# EAGLE design xyshield_final (EAGLE 6.5.0)
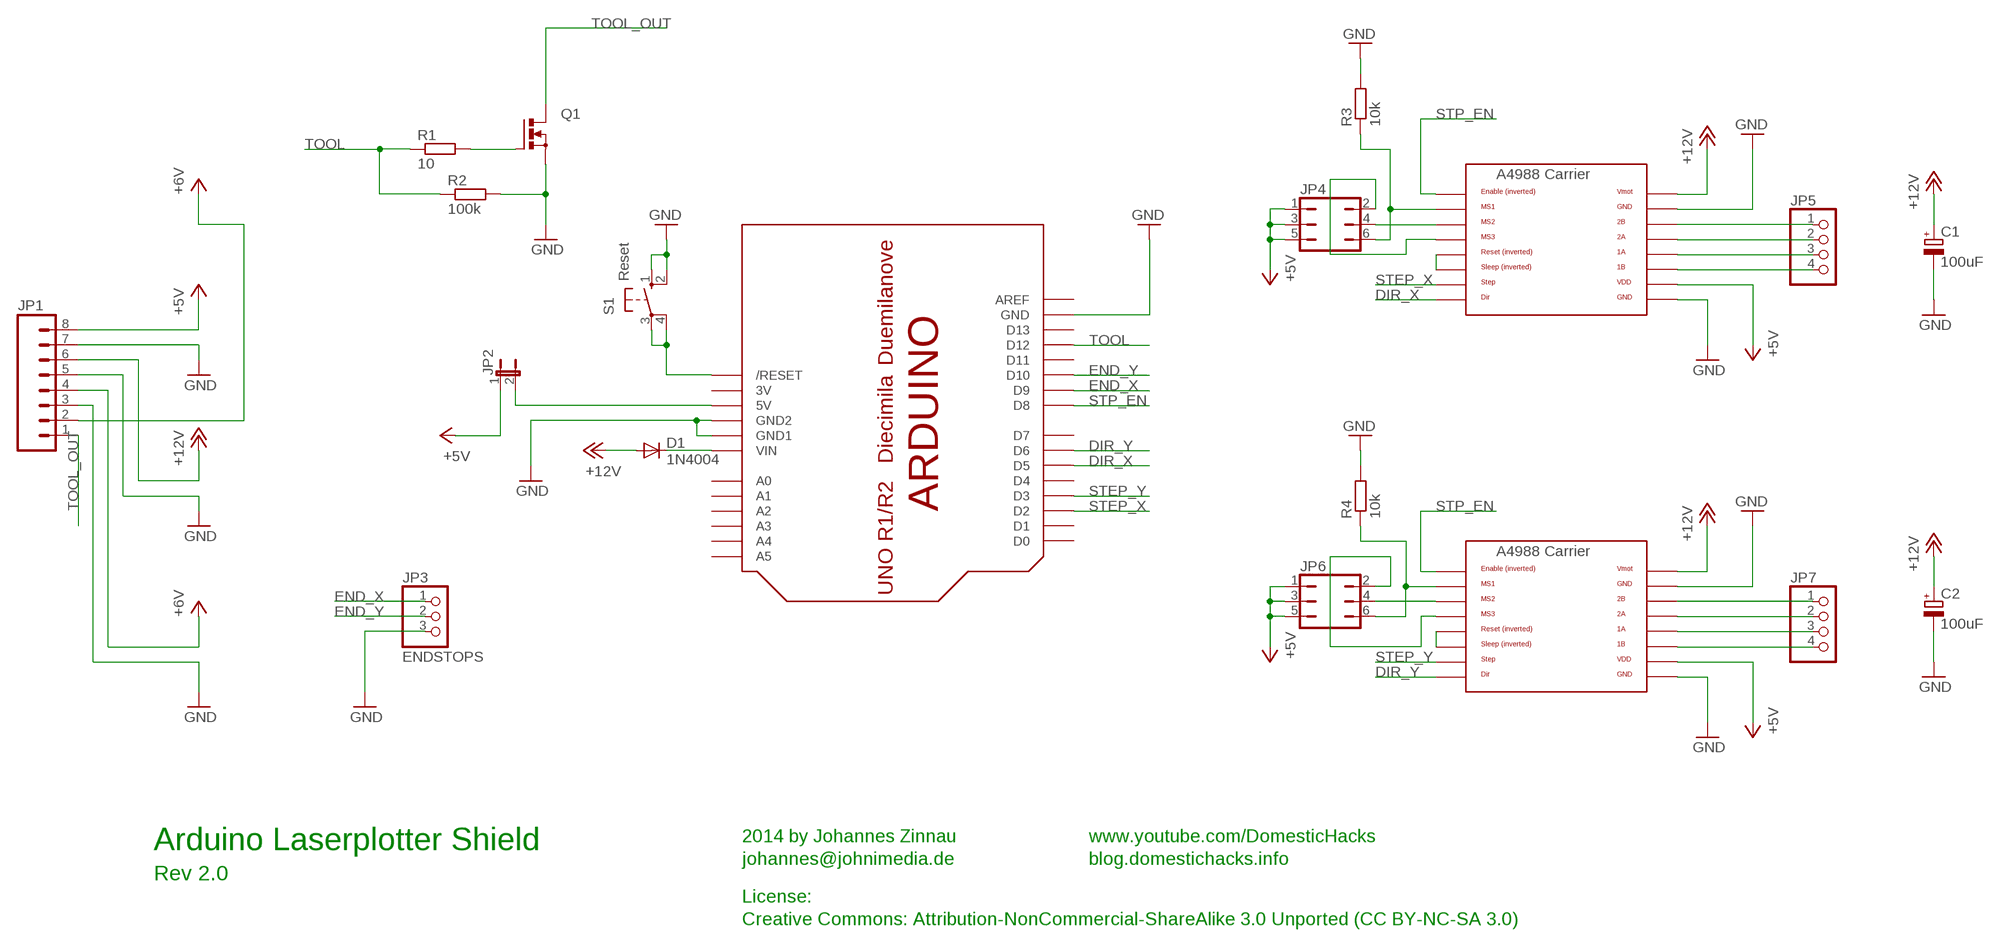
[diagram p0: schematic, sheet 1]

## Parts
C1  100uF  CPOL-EUE2.5-6  [E2,5-6]
C2  100uF  CPOL-EUE2.5-6  [E2,5-6]
D1  1N4004  [DO41-10]
JP1  M083.5MM-8  [SCREWTERMINAL-3.5MM-8]
JP2  JUMPER-2PTH  [1X02]
JP3  ENDSTOPS  PINHD-1X3  [1X03]
JP4  JP3Q  [JP3Q]
JP5  PINHD-1X4  [1X04]
JP6  JP3Q  [JP3Q]
JP7  PINHD-1X4  [1X04]
Q1  PMOSFET_NTO220BV  [TO220BV]
R1  10  R-EU_0207/10  [0207/10]
R2  100k  R-EU_0207/10  [0207/10]
R3  10k  R-EU_0207/2V  [0207/2V]
R4  10k  R-EU_0207/2V  [0207/2V]
S1  Reset  10-XX  [B3F-10XX]
U$1  POLOLU_A4983CARRIER  [A4988BREAKOUT]
U$2  POLOLU_A4983CARRIER  [A4988BREAKOUT]
U$3  ARDUINOUNO  [ARDUINO]

## Nets
+5V: JP1.8 JP2.1 JP4.1 JP4.3 JP4.5 JP6.1 JP6.3 JP6.5 U$1.VDD U$2.VDD
+12V: C1.+ C2.+ D1.A JP1.6 U$1.VMOT U$2.VMOT
DIR_X: U$1.DIR U$3.D5
DIR_Y: U$2.DIR U$3.D6
END_X: JP3.1 U$3.D9
END_Y: JP3.2 U$3.D10
GND: C1.- C2.- JP1.3 JP1.5 JP1.7 JP3.3 Q1.S R2.2 R3.2 R4.2 S1.1(S) S1.2(S1) U$1.GND U$1.GND@0(GND) U$2.GND U$2.GND@0(GND) U$3.GND U$3.GND1 U$3.GND2
N$2: Q1.G R1.2
N$3: U$1.RST U$1.SLP(SLEEP)
N$4: JP5.3 U$1.1A
N$5: JP5.2 U$1.2A
N$6: JP5.1 U$1.2B
N$7: JP5.4 U$1.1B
N$8: JP4.6 R3.1 U$1.MS1
N$9: JP4.4 U$1.MS2
N$10: JP4.2 U$1.MS3
N$11: U$2.RST U$2.SLP(SLEEP)
N$12: JP7.4 U$2.1B
N$13: JP7.3 U$2.1A
N$14: JP7.2 U$2.2A
N$15: JP7.1 U$2.2B
N$16: JP6.6 R4.1 U$2.MS1
N$17: JP6.4 U$2.MS2
N$18: JP6.2 U$2.MS3
N$19: JP2.2 U$3.5V
N$25: D1.C U$3.VIN
N$28: S1.3(P) S1.4(P1) U$3.RESET(/RESET)
STEP_X: U$1.STEP U$3.D2
STEP_Y: U$2.STEP U$3.D3
STP_EN: U$1.EN U$2.EN U$3.D8
TOOL: R1.1 R2.1 U$3.D12
TOOL_OUT: JP1.1 Q1.D
VCC: JP1.2 JP1.4 ; supply symbol labelled +6V
Unconnected: U$3.A0 U$3.A1 U$3.A2 U$3.A3 U$3.A4 U$3.A5 U$3.AREF U$3.D0 U$3.D1 U$3.D4 U$3.D7 U$3.D11 U$3.D13

## Notes on the sheet
- 2014 by Johannes Zinnau | www.youtube.com/DomesticHacks
- Arduino Laserplotter Shield
- johannes@johnimedia.de | blog.domestichacks.info
- Rev 2.0
- License:
- Creative Commons: Attribution-NonCommercial-ShareAlike 3.0 Unported (CC BY-NC-SA 3.0)

## Power pins joined to a net without a drawn wire
3V: U$3.3V

## Library data of the parts
C1 C2 = rcl:CPOL-EU: POLARIZED CAPACITOR, European symbol
D1 = diode:1N4004: DIODE general purpose rectifier, 1 A
JP1 = SparkFun-Connectors:M08: Header 8 Standard 8-pin 0.1" header. Use with straight break away headers (SKU : PRT-00116), right angle break away headers (PRT-00553), swiss pins (PRT-00743), machine pins (PRT-00117), and female headers (PRT-00115).
JP2 = SparkFun-Passives:JUMPER-2: Jumper Basic 0.1" spaced jumper. Use with breakaway headers.
JP3 = pinhead:PINHD-1X3: PIN HEADER
JP4 JP6 = jumper:JP3Q: JUMPER
JP5 JP7 = pinhead:PINHD-1X4: PIN HEADER
Q1 = transistor-power:PMOSFET_N: Power MOSFET N-Channel
R1-R4 = rcl:R-EU_: RESISTOR, European symbol
S1 = switch-omron:10-XX: OMRON SWITCH; MPN: B3F-1000; OC_FARNELL: 176432; OC_NEWARK: 36M3542
U$1 U$2 = RepRapjr:POLOLU_A4983CARRIER
U$3 = adafruit:ARDUINO: Arduino Diecimila/Duemilanove Make a shield with ease, this package has all the named pins as well as the two mounting drill holes and an outline of the USB and DC power connector. The outline is on the DIMENSION layer, so if your board house uses it they will cut the outline to match. http://www.ladyada.net/library/pcb/eaglelibrary.html

## Board
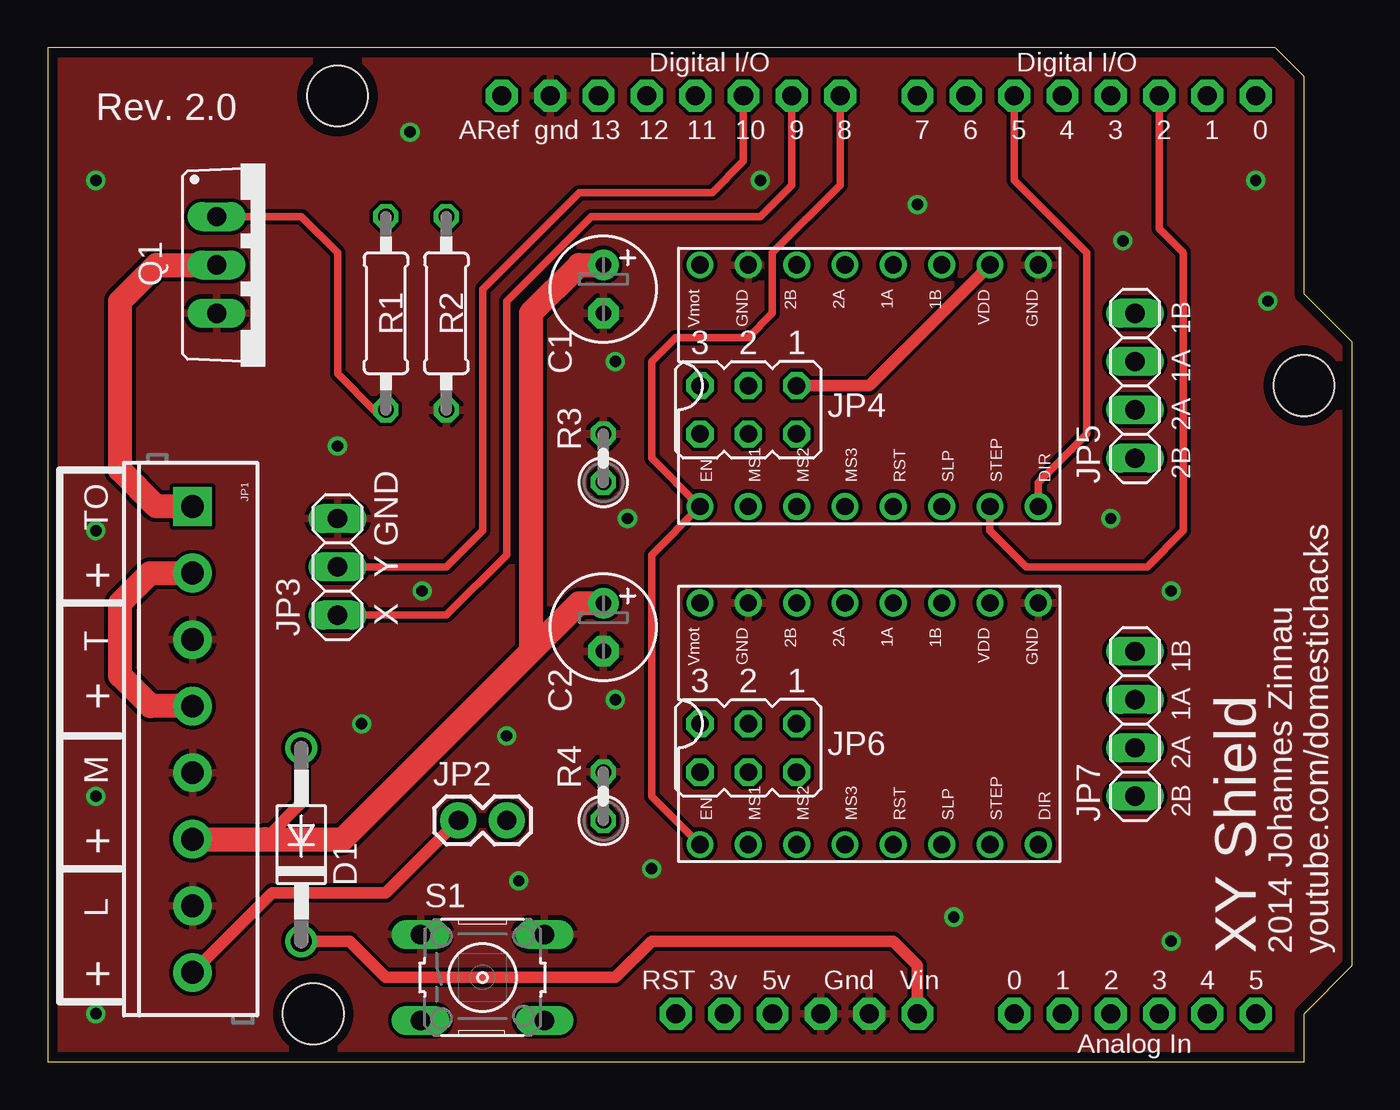
[diagram p1: board, top side]
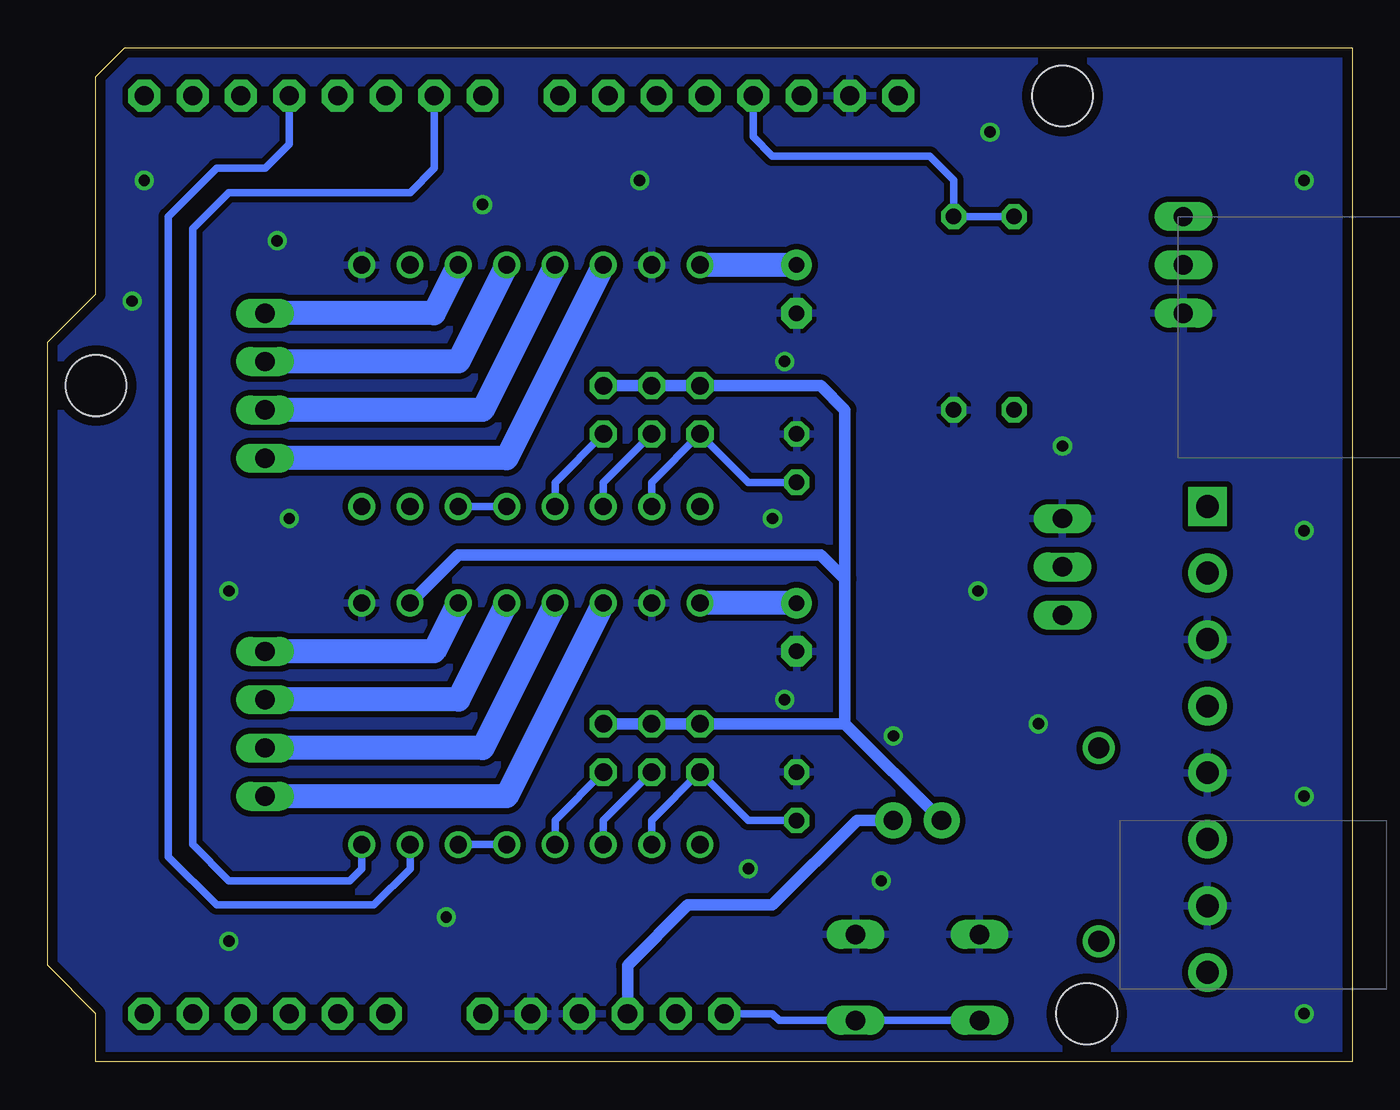
[diagram p2: board, bottom side, seen from below]

Size 68.58 x 53.34 mm. Coordinates in mm from the lower left corner, seen from the top.
Copper layers (1*16): Top 0.035mm / dielectric 1.5mm / Bottom 0.035mm
Design rules "default *": minimum track width 10mil, minimum drill 12mil, track to track 8mil, track to pad 8mil, pad to pad 8mil, via to via 8mil, smd to smd 8mil, copper to edge 20mil, drill to drill 10mil, minimum pad ring 10mil, minimum via ring 8mil, stop-mask expansion 4mil, vias tented up to drill 0mil, thermal gap 10mil

### Footprints (pad centres in the part's own frame; a part is rotated, then mirrored left to right if it is on the bottom)
E2,5-6 = drill 0.813 pad 1.6: + -1.27,0 | drill 0.813 pad 1.6 octagon: - 1.27,0
DO41-10 = drill 1.118: A 5.08,0; C -5.08,0
SCREWTERMINAL-3.5MM-8 = drill 1.2 pad 2.032 square: 1 0,0 | drill 1.2 pad 2.032: 2 3.5,0; 3 7,0; 4 10.5,0; 5 14,0; 6 17.5,0; 7 21,0; 8 24.5,0
1X02 = drill 1.016 pad 1.88: 1 0,0; 2 2.54,0
1X03 = drill 1.016 long: 1 -2.54,0; 2 0,0; 3 2.54,0
JP3Q = drill 0.914 octagon: 1 -2.54,-1.27; 2 -2.54,1.27; 3 0,-1.27; 4 0,1.27; 5 2.54,-1.27; 6 2.54,1.27
1X04 = drill 1.016 long: 1 -3.81,0; 2 -1.27,0; 3 1.27,0; 4 3.81,0
TO220BV = drill 1.016 long: D 0,-2.54; G -2.54,-2.54; S 2.54,-2.54
0207/10 = drill 0.813 octagon: 1 -5.08,0; 2 5.08,0
0207/2V = drill 0.813 octagon: 1 -1.27,0; 2 1.27,0
B3F-10XX = drill 1.016 long: 1 -3.251,2.261; 2 3.251,2.261; 3 -3.251,-2.261; 4 3.251,-2.261
A4988BREAKOUT = drill 0.9: 1A 8.89,1.27; 1B 11.43,1.27; 2A 6.35,1.27; 2B 3.81,1.27; DIR 16.51,-11.43; EN -1.27,-11.43; GND 16.51,1.27; GND@0 1.27,1.27; MS1 1.27,-11.43; MS2 3.81,-11.43; MS3 6.35,-11.43; RST 8.89,-11.43; SLP 11.43,-11.43; STEP 13.97,-11.43; VDD 13.97,1.27; VMOT -1.27,1.27
ARDUINO = drill 1 pad 1.676 octagon: 3V 35.56,2.54; 5V 38.1,2.54; A0 50.8,2.54; A1 53.34,2.54; A2 55.88,2.54; A3 58.42,2.54; A4 60.96,2.54; A5 63.5,2.54; AREF 23.876,50.8; D0 63.5,50.8; D1 60.96,50.8; D2 58.42,50.8; D3 55.88,50.8; D4 53.34,50.8; D5 50.8,50.8; D6 48.26,50.8; D7 45.72,50.8; D8 41.656,50.8; D9 39.116,50.8; D10 36.576,50.8; D11 34.036,50.8; D12 31.496,50.8; D13 28.956,50.8; GND 26.416,50.8; GND1 43.18,2.54; GND2 40.64,2.54; RESET 33.02,2.54; VIN 45.72,2.54 | hole 3.2: 15.24,50.8; 66.04,35.56; 13.97,2.54

### Placement (x,y rotation side)
C1  29.21,40.64 270 top
C2  29.21,22.86 270 top
D1  13.34,11.43 90 top
JP1  7.62,29.21 270 top
JP2  21.59,12.7 0 top
JP3  15.24,26.04 90 top
JP4  36.83,34.29 180 top
JP5  57.15,35.56 90 top
JP6  36.83,16.51 180 top
JP7  57.15,17.78 90 top
Q1  11.43,41.91 270 top
R1  17.78,39.37 270 top
R2  20.95,39.37 270 top
R3  29.21,31.75 90 top
R4  29.21,13.97 90 top
S1  22.86,4.45 0 top
U$1  35.56,40.64 0 top
U$2  35.56,22.86 0 top
U$3  0,0 0 top

### Tracks (layer width: path | path; a pad name or v marks a point on that pad's centre or on a via)
+5V
  Top 0.61: JP4.1 43.18,35.56 U$1.VDD | JP1.8 11.8,8.89 17.78,8.89 JP2.1
  Bottom 0.61: JP4.1 JP4.3 JP4.5 27.94,35.56 26.67,34.29 26.67,25.4 | 26.67,17.78 26.67,25.4 | 26.67,17.78 JP6.5 JP6.3 JP6.1 | U$2.VDD 46.99,26.67 27.94,26.67 26.67,25.4 | 26.67,17.78 JP2.1
+12V
  Top 0.61: D1.A 13.34,13.62 11.43,11.71
  Top 1.27: C1.+ 27.94,41.91 25.4,39.37 25.4,21.59 | C2.+ 27.94,24.13 25.4,21.59 | 25.4,21.59 15.52,11.71 11.43,11.71 JP1.6
  Bottom 1.27: C1.+ U$1.VMOT | C2.+ U$2.VMOT
DIR_X
  Top 0.406: U$3.D5 50.8,46.36 54.61,42.55 54.61,33.02 52.07,30.48 U$1.DIR
DIR_Y
  Bottom 0.406: U$2.DIR 52.07,10.16 52.7,9.53 59.05,9.53 60.96,11.43 60.96,43.82 59.05,45.72 49.53,45.72 48.26,46.99 U$3.D6
END_X
  Top 0.406: U$3.D9 39.12,46.1 37.47,44.45 28.57,44.45 24.13,40.01 24.13,26.67 20.95,23.5 JP3.1
END_Y
  Top 0.406: JP3.2 20.95,26.04 22.86,27.94 22.86,40.64 27.94,45.72 34.92,45.72 36.58,47.37 U$3.D10
GND  (via drill 0.6)
  other vias: 2.54,46.36 31.75,10.16 29.84,19.05 15.24,32.38 59.05,24.77 47.62,7.62 64.14,40.01 45.72,45.09 19.05,48.9 19.68,24.77 24.77,9.53 30.48,28.57 56.52,43.18 55.88,28.57 2.54,2.54 2.54,13.97 2.54,27.94 29.84,36.83 16.51,17.78 37.47,46.36 24.13,17.14 59.05,6.35 63.5,46.36
  pour Bottom (isolate 0.305): 0,53.34 64.77,53.34 66.04,52.07 66.04,40.64 68.58,38.1 68.58,5.08 66.04,2.54 66.04,0 0,0
  pour Top: 0,53.34 0,0 66.04,0 66.04,2.54 68.58,5.08 68.58,38.1 66.04,40.64 66.04,52.07 64.77,53.34
N$2
  Top 0.406: R1.2 17.14,34.29 15.24,36.2 15.24,42.55 13.34,44.45 Q1.G
N$3
  Bottom 0.406: U$1.RST U$1.SLP
N$4
  Bottom 1.27: JP5.3 46.99,36.83 U$1.1A
N$5
  Bottom 1.27: JP5.2 45.72,34.29 U$1.2A
N$6
  Bottom 1.27: U$1.2B 44.45,31.75 JP5.1
N$7
  Bottom 1.27: JP5.4 48.26,39.37 U$1.1B
N$8
  Bottom 0.406: U$1.MS1 36.83,30.48 JP4.6 31.75,30.48 R3.1
N$9
  Bottom 0.406: JP4.4 39.37,30.48 U$1.MS2
N$10
  Bottom 0.406: JP4.2 41.91,30.48 U$1.MS3
N$11
  Bottom 0.406: U$2.RST U$2.SLP
N$12
  Bottom 1.27: U$2.1B 48.26,21.59 JP7.4
N$13
  Bottom 1.27: JP7.3 46.99,19.05 U$2.1A
N$14
  Bottom 1.27: U$2.2A 45.72,16.51 JP7.2
N$15
  Bottom 1.27: U$2.2B 44.45,13.97 JP7.1
N$16
  Bottom 0.406: U$2.MS1 36.83,12.7 JP6.6 31.75,12.7 R4.1
N$17
  Bottom 0.406: U$2.MS2 39.37,12.7 JP6.4
N$18
  Bottom 0.406: U$2.MS3 41.91,12.7 JP6.2
N$19
  Bottom 0.61: U$3.5V 38.1,5.08 34.92,8.26 30.48,8.26 26.04,12.7 JP2.2
N$25
  Top 0.61: U$3.VIN 45.72,5.08 44.45,6.35 31.75,6.35 29.84,4.45 17.78,4.45 15.88,6.35 D1.C
N$28
  Bottom 0.406: S1.3 S1.4 30.12,2.18 30.48,2.54 U$3.RESET
STEP_X
  Top 0.406: U$3.D2 58.42,43.82 59.69,42.55 59.69,27.94 57.78,26.04 51.44,26.04 49.53,27.94 U$1.STEP
STEP_Y
  Bottom 0.406: U$2.STEP 49.53,10.16 51.44,8.26 59.69,8.26 62.23,10.79 62.23,44.45 59.69,46.99 57.15,46.99 55.88,48.26 U$3.D3
STP_EN
  Top 0.406: U$3.D8 41.66,46.1 38.1,42.55 38.1,39.37 36.83,38.1 33.02,38.1 31.75,36.83 31.75,31.75 U$1.EN 31.75,26.67 31.75,13.97 U$2.EN
TOOL
  Bottom 0.406: R1.1 R2.1 20.95,46.36 22.23,47.62 30.48,47.62 31.5,48.64 U$3.D12
TOOL_OUT
  Top 1.27: JP1.1 5.71,29.21 3.81,31.11 3.81,40.01 5.71,41.91 Q1.D
VCC
  Top 1.27: JP1.2 5.39,25.71 3.81,24.13 3.81,20.32 5.42,18.71 JP1.4

### Text on the board
tNames: Rev. 2.0 | 1B | 1A | 2A | 2B | GND | TO | Y | + | X | 1B | T | 1A | + | 2A | M | 2B | + | L | XY Shield | 2014 Johannes Zinnau | youtube.com/domestichacks | +